# EAGLE design AIR (EAGLE 9.6.2)
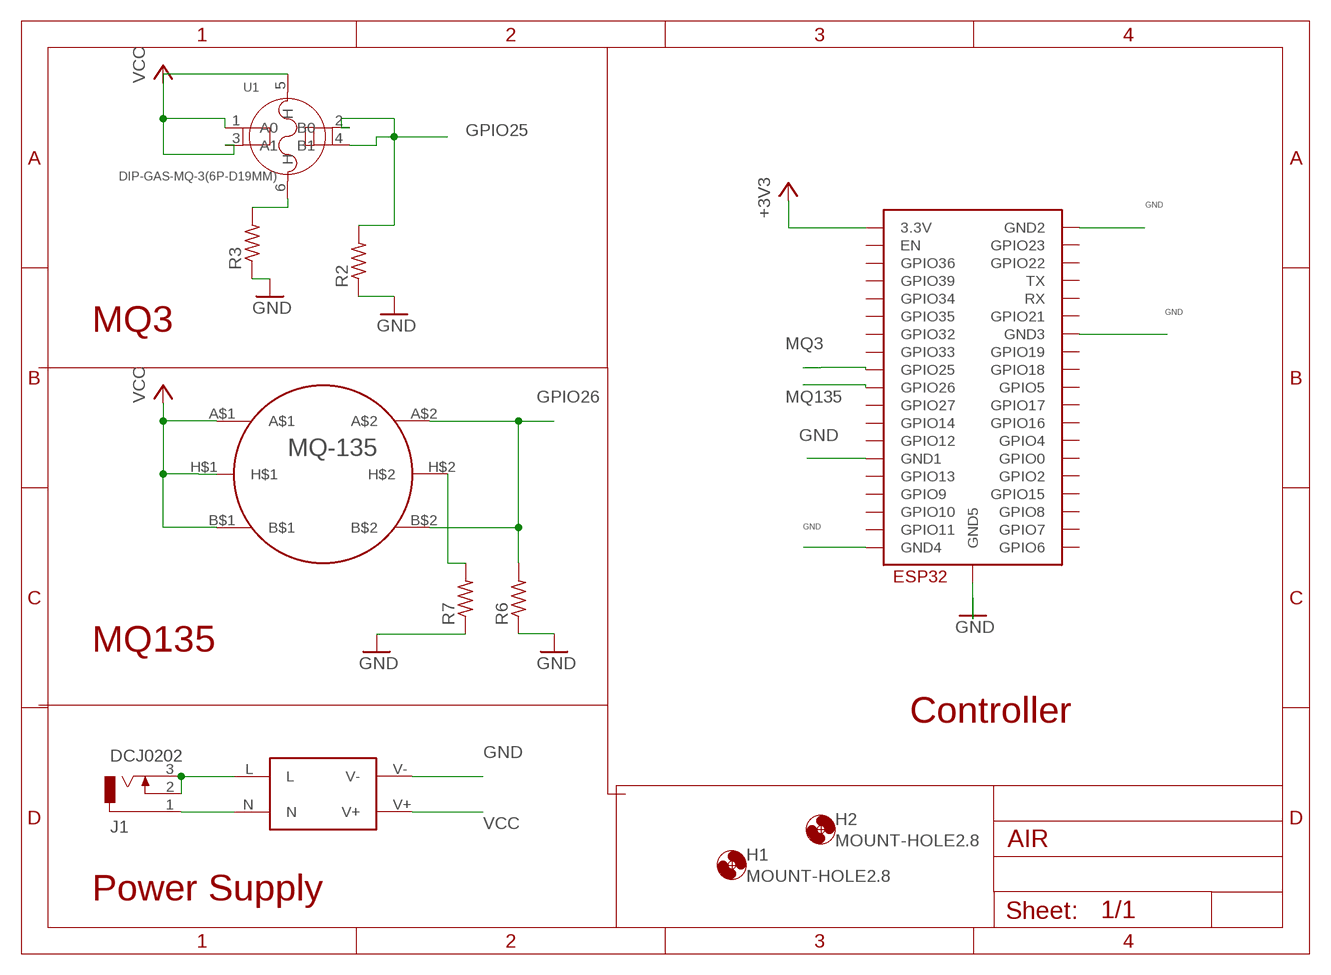
[diagram p0: schematic, sheet 1]

## Parts
H1  MOUNT-HOLE2.8  [2,8]
H2  MOUNT-HOLE2.8  [2,8]
J1  DCJ0202  [DCJ0202]
R2  R-US_0204/7  [0204/7]
R3  R-US_0204/7  [0204/7]
R6  R-US_0204/7  [0204/7]
R7  R-US_0204/7  [0204/7]
U1  DIP-GAS-MQ-3(6P-D19MM)  [SNR6-D19.0MM]
U$1  ESP32-WROOM  [ESP32-WROOM]
U$2  HLK-PM01  [HLK-PM01-PAK]
U$3  MQ_135_A  [MQ-135]

## Nets
+3V3: U$1.3V3(3.3V)
GND: R2.1 R3.1 R6.1 R7.1 U$1.GND1 U$1.GND2 U$1.GND3 U$1.GND4 U$1.GND5 U$2.V-
GPIO25: R2.2 U1.2(B0) U1.4(B1)
GPIO26: R6.2 U$3.A$2 U$3.B$2
MQ3: U$1.IO25(GPIO25)
MQ135: U$1.IO26(GPIO26)
N$1: J1.2 J1.3 U$2.L
N$2: R3.2 U1.6(H)
N$4: J1.1 U$2.N
N$6: R7.2 U$3.H$2
VCC: U1.1(A0) U1.3(A1) U1.5(H) U$2.V+ U$3.A$1 U$3.B$1 U$3.H$1
Unconnected: U$1.CLK(GPIO6) U$1.CMD(GPIO11) U$1.EN U$1.IO0(GPIO0) U$1.IO2(GPIO2) U$1.IO4(GPIO4) U$1.IO5(GPIO5) U$1.IO12(GPIO12) U$1.IO13(GPIO13) U$1.IO14(GPIO14) U$1.IO15(GPIO15) U$1.IO16(GPIO16) U$1.IO17(GPIO17) U$1.IO18(GPIO18) U$1.IO19(GPIO19) U$1.IO21(GPIO21) U$1.IO22(GPIO22) U$1.IO23(GPIO23) U$1.IO27(GPIO27) U$1.IO32(GPIO32) U$1.IO33(GPIO33) U$1.IO34(GPIO34) U$1.IO35(GPIO35) U$1.RX U$1.SD0(GPIO7) U$1.SD1(GPIO8) U$1.SD2(GPIO9) U$1.SD3(GPIO10) U$1.SENSOR_VN(GPIO39) U$1.SENSOR_VP(GPIO36) U$1.TX

## Notes on the sheet
- MQ3
- MQ135
- Controller
- Power Supply

## Library data of the parts
H1 H2 = holes:MOUNT-HOLE: MOUNTING HOLE with drill center marker
J1 = con-jack:DCJ0202: DC POWER JACK Source: DCJ0202.pdf; OC_FARNELL: unknown; OC_NEWARK: unknown
R2 R3 R6 R7 = rcl:R-US_: RESISTOR, American symbol; SPICEPREFIX: R
U1 = DIP-GAS-MQ-3_6P-D19MM_:DIP-GAS-MQ-3(6P-D19MM): 314100007 Check prices <https://pricing.snapeda.com/parts/MQ3/Samsung%20Electro-Mechanics/view-part?ref=eda>; AVAILABILITY: In Stock; DESCRIPTION: 2.2µF ±20% 6.3V Ceramic Capacitor X5R 0201 (0603 Metric); MF: Samsung Electro-Mechanics; MP: MQ3; PACKAGE: 0201 Samsung Electro-Mechanics; PRICE: None
U$1 = ESP32:ESP32-WROOM
U$2 = HLK-PM01:HLK-PM01: Check prices <https://pricing.snapeda.com/parts/hlk-pm01/Hi-link/view-part?ref=eda>; AVAILABILITY: No availability data; DESCRIPTION: The 3W ultra-small series module power supply is a small-volume, high-efficiency AC DC power module supply designed by Shenzhen Hi-Link Electronics Co.,Ltd. It has the advantages of global input voltage range, low temperature rise, low power consumption,high efficiency, high reliability and high safety isolation. It has been widely used in smart home, automation control, communications equipment, instrumentation and other industries.; MF: Hi-link; MP: hlk-pm01; PACKAGE: Package; PRICE: None
U$3 = MQ_135_A:MQ_135_A

## Board
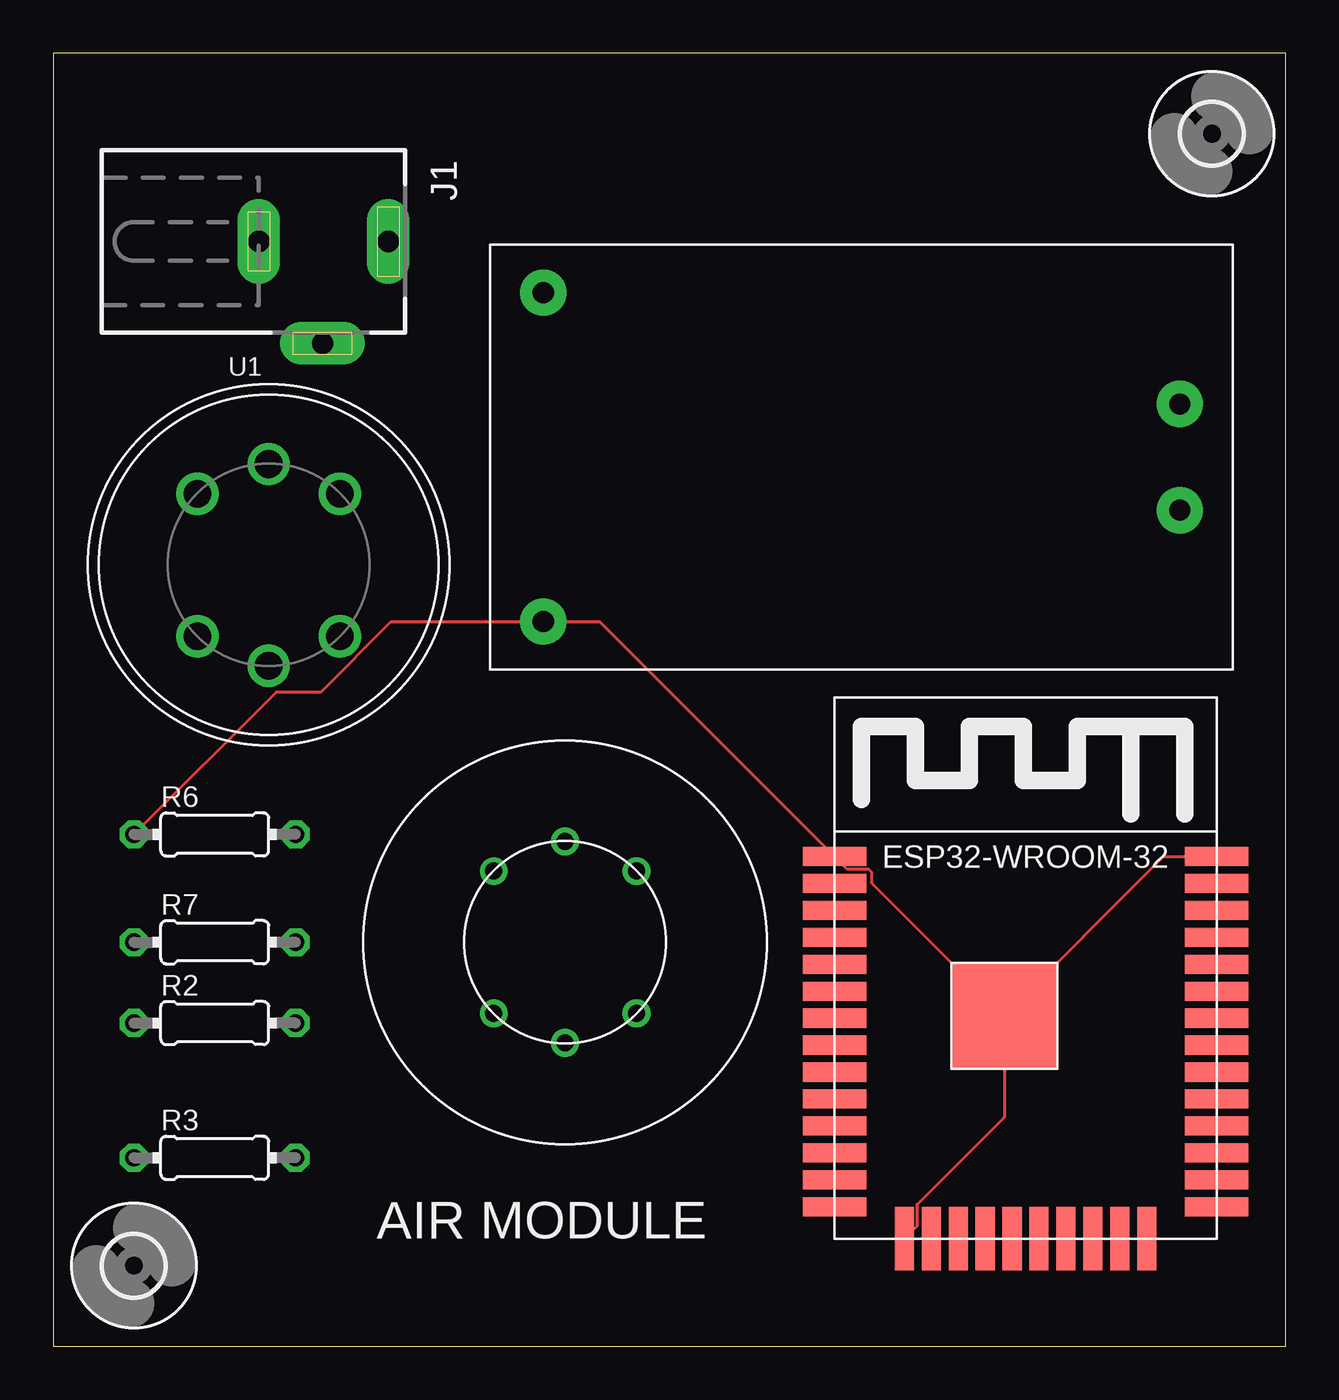
[diagram p1: board, top side]
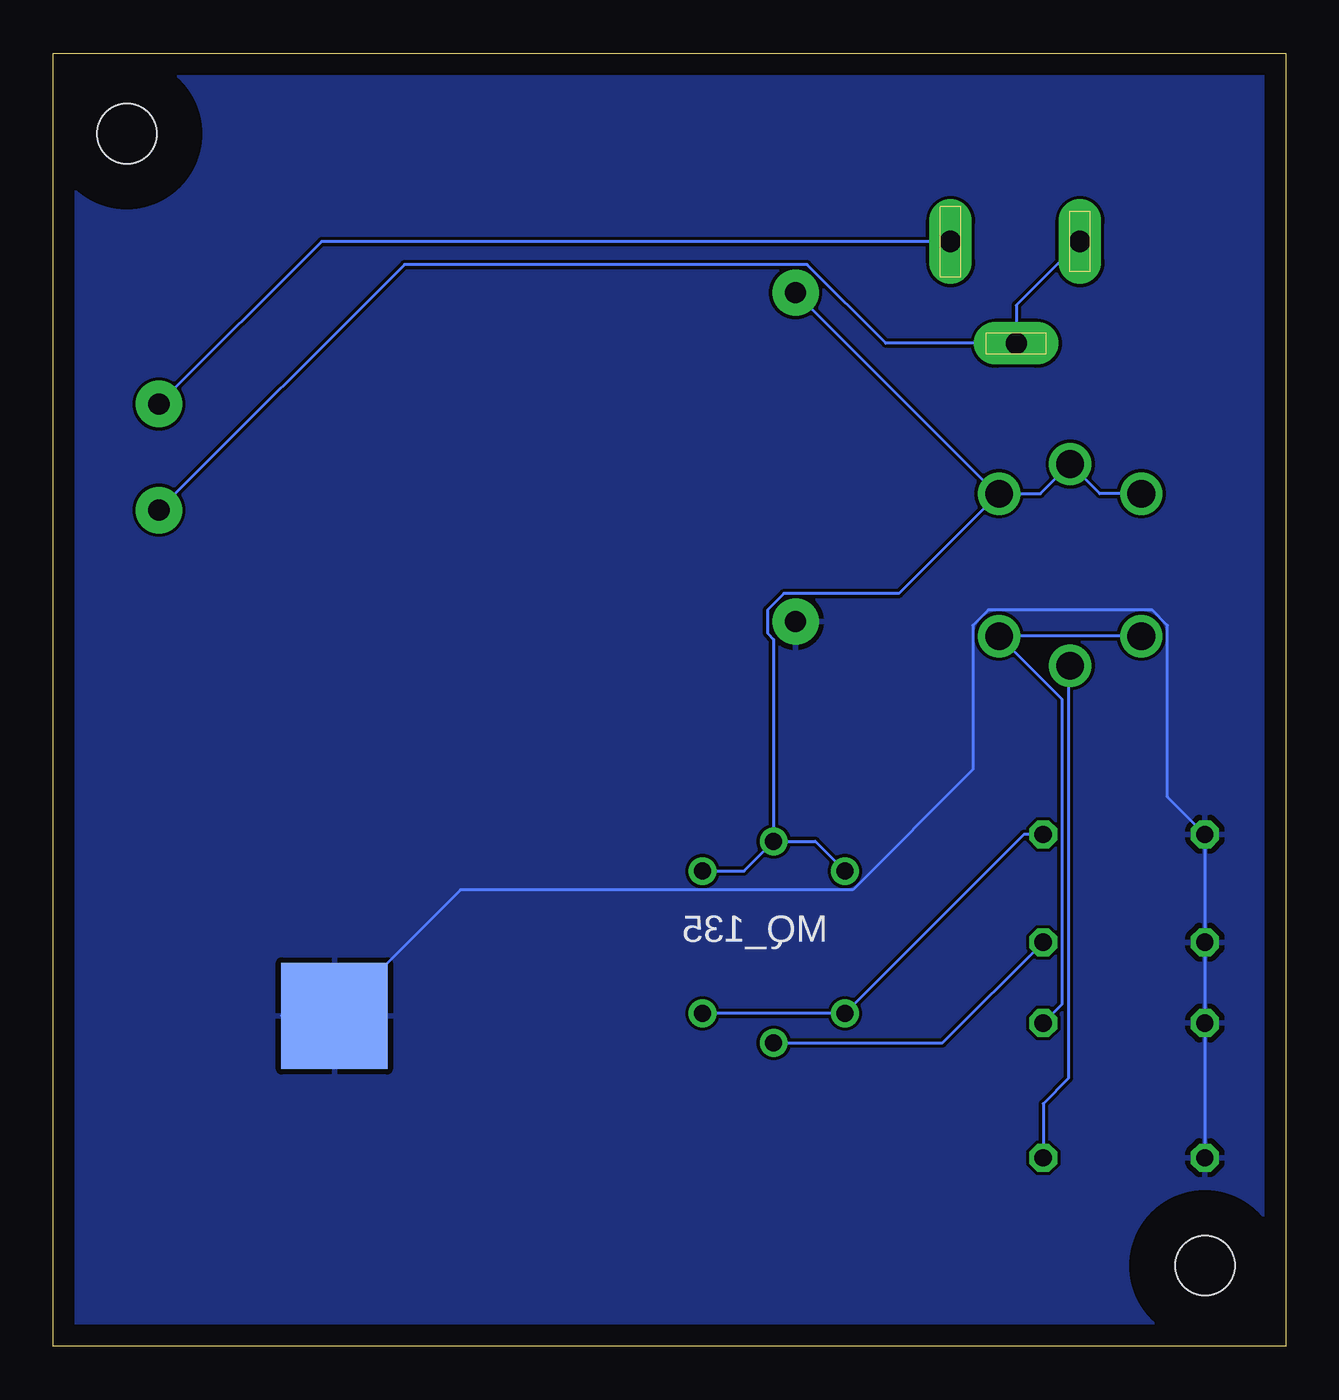
[diagram p2: board, bottom side, seen from below]

Size 58.09 x 60.95 mm. Coordinates in mm from the lower left corner, seen from the top.
Outline: 0,0 58.09,0 58.09,60.95 0,60.95 0,0
Copper layers (1*16): Top 0.035mm / dielectric 1.5mm / Bottom 0.035mm
Design rules "default": minimum track width 6mil, minimum drill 0.35mm, track to track 6mil, track to pad 6mil, pad to pad 6mil, via to via 6mil, smd to smd 6mil, copper to edge 40mil, drill to drill 6mil, minimum pad ring 10mil, minimum via ring 8mil, stop-mask expansion 4mil, vias tented up to drill 0mil, thermal gap 10mil

### Footprints (pad centres in the part's own frame; a part is rotated, then mirrored left to right if it is on the bottom)
2,8 = hole 2.8: 0,0
DCJ0202 = drill 1 pad 2 long: 1 0,3.1; 2 4.8,0; 3 0,-3
0204/7 = drill 0.813 octagon: 1 -3.81,0; 2 3.81,0
SNR6-D19.0MM = drill 1.3 pad 2: 1 -3.355,3.355; 2 -3.355,-3.355; 3 3.355,3.355; 4 3.355,-3.355; 5 0,4.75; 6 0,-4.75
ESP32-WROOM = smd 3 x 0.9: 3V3 0,16.74; EN 0,15.47; GND1 0,18.01; GND3 18,18.01; IO0 18,1.5; IO4 18,2.77; IO5 18,6.58; IO12 0,1.5; IO14 0,2.77; IO16 18,4.04; IO17 18,5.31; IO18 18,7.85; IO19 18,9.12; IO21 18,11.66; IO22 18,15.47; IO23 18,16.74; IO25 0,6.58; IO26 0,5.31; IO27 0,4.04; IO32 0,9.12; IO33 0,7.85; IO34 0,11.66; IO35 0,10.39; NC 18,10.39; RX 18,12.93; SENSOR_VN 0,12.93; SENSOR_VP 0,14.2; TX 18,14.2 | smd 0.9 x 3: CLK 9.635,0; CMD 8.365,0; GND2 3.285,0; IO2 14.715,0; IO13 4.555,0; IO15 13.445,0; SD0 10.905,0; SD1 12.175,0; SD2 5.825,0; SD3 7.095,0 | smd 5 x 5: GND4 8,10.5 | smd 5 x 5 bottom: GND5 8,10.5
HLK-PM01-PAK = drill 1 pad 2.184: L -15,2.5; N -15,-2.5; V+ 15,-7.75; V- 15,7.75
MQ-135 = drill 0.8: A$1 -3.36,3.35; A$2 -3.36,-3.35; B$1 3.36,3.35; B$2 3.36,-3.35; H$1 0,4.75; H$2 0,-4.75

### Placement (x,y rotation side)
H1  3.81,3.81 0 top
H2  54.61,57.15 0 top
J1  12.7,52.07 270 top
R2  7.62,15.24 0 top
R3  7.62,8.89 0 top
R6  7.62,24.13 0 top
R7  7.62,19.05 0 top
U1  10.16,36.83 0 top
U$1  36.83,5.08 0 top
U$2  38.1,41.91 180 top
U$3  24.13,19.05 0 top

### Tracks (layer width: path | path; a pad name or v marks a point on that pad's centre or on a via)
GND
  Top 0.152: 54.61,22.86 U$1.GND3 | U$1.GND3 | U$1.GND2 40.71,5.67 40.71,6.67 44.83,10.8 U$1.GND4 | U$1.GND4 38.56,21.85 38.56,22.36 38.42,22.5 37.42,22.5 U$1.GND1 25.76,34.16 U$2.V- 15.94,34.16 12.63,30.85 10.53,30.85 R6.1 | U$1.GND4 52.33,23.08 U$1.GND3
  Bottom 0.152: R3.1 R2.1 R7.1 R6.1 5.58,25.9 5.58,33.98 6.3,34.7 14.02,34.7 14.74,33.98 14.74,27.18 20.4,21.52 38.89,21.52 U$1.GND4 | U$2.V- 22.86,34.16 | U$1.GND4 47.33,15.58 | U$1.GND4 45.38,15.58 45.72,15.24
  pour Bottom: 0,60.96 58.42,60.96 58.42,0 0,0
GPIO25
  Bottom 0.152: U1.2 U1.4 10.54,30.5 10.54,16.13 R2.2
GPIO26
  Bottom 0.152: R6.2 12.34,24.13 U$3.A$2 U$3.B$2
N$1
  Bottom 0.152: J1.3 12.7,49.07 J1.2 | 12.7,46.99 J1.2 | J1.2 18.84,47.27 22.55,50.98 41.53,50.98 U$2.L
N$2
  Bottom 0.152: 9.99,32.25 U1.6 10.24,32 10.24,12.64 11.43,11.44 R3.2
N$4
  Bottom 0.152: J1.1 45.44,52.07 U$2.N
N$6
  Bottom 0.152: U$3.H$2 16.18,14.3 R7.2
VCC
  Bottom 0.152: U1.1 8.77,40.19 U1.5 11.55,40.19 U1.3 | U$3.B$1 25.53,22.4 U$3.H$1 | U$3.H$1 22.17,23.8 U$3.A$1 | U$2.V+ 13.62,40.19 U1.3 | U1.3 18.22,35.48 23.65,35.48 24.42,34.71 24.42,33.61 24.13,33.32 U$3.H$1

### Text on the board
tPlace: AIR MODULE